# EAGLE design odbiornikpolygon (EAGLE 8.5.0)
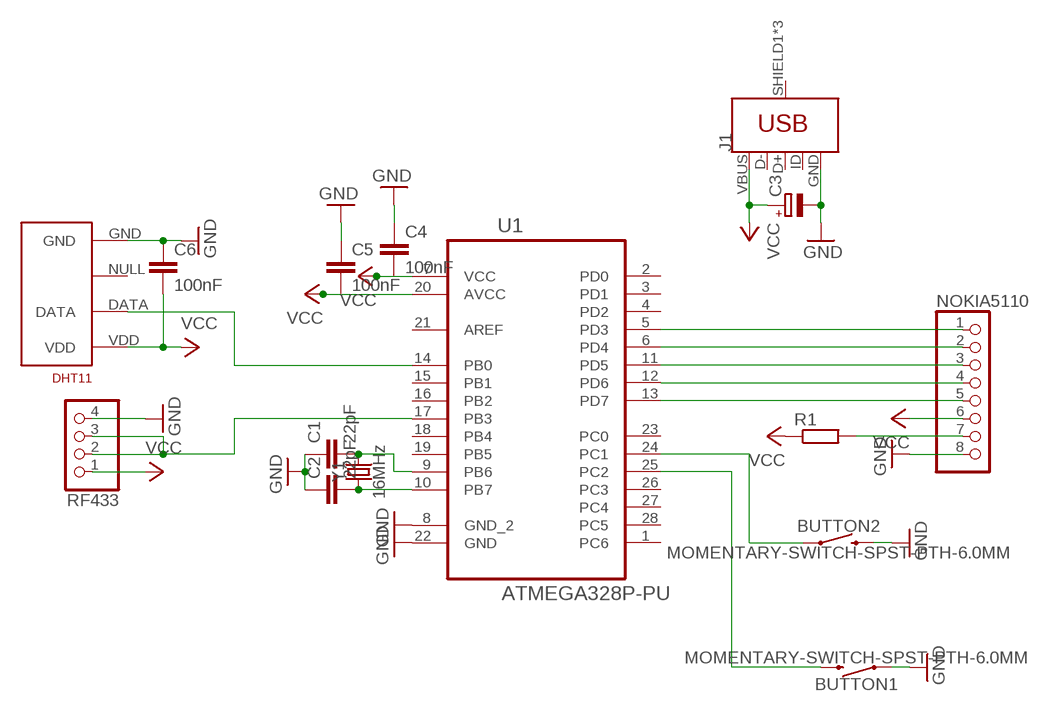
[diagram p0: schematic, sheet 1]

## Parts
BUTTON1  MOMENTARY-SWITCH-SPST-PTH-6.0MM  [TACTILE_SWITCH_PTH_6.0MM]
BUTTON2  MOMENTARY-SWITCH-SPST-PTH-6.0MM  [TACTILE_SWITCH_PTH_6.0MM]
C1  22pF  C-EU025-024X044  [C025-024X044]
C2  22pF  C-EU025-024X044  [C025-024X044]
C3  CPOL-EUE2-5  [E2-5]
C4  100nF  C-EU025-030X050  [C025-030X050]
C5  100nF  C-EU025-030X050  [C025-030X050]
C6  100nF  C-EU025-030X050  [C025-030X050]
DHT11  RHT03_DHT-22_AM2302  [RHT03_DHT-22]
J1  USB_MICRO-BREDUCED_PASTE  [USB-B-MICRO-SMD_RED_PASTE]
NOKIA5110  PINHD-1X8  [1X08]
R1  R-EU_0204/7  [0204/7]
RF433  PINHD-1X4  [1X04]
U1  ATMEGA328P-PU  [DIP254P762X457-28]
Y1  16MHz  CRYSTAL-16MHZPTH-HC49US  [HC49US]

## Nets
BL: NOKIA5110.7 R1.2
CE: NOKIA5110.2 U1.6(PD4)
CLK: NOKIA5110.5 U1.13(PD7)
DC: NOKIA5110.3 U1.11(PD5)
DIN: NOKIA5110.4 U1.12(PD6)
GND: BUTTON1.1 BUTTON2.3 C1.1 C2.1 C3.- C4.1 C5.1 C6.1 DHT11.GND J1.GND NOKIA5110.8 RF433.4 U1.8(GND_2) U1.22(GND)
N$1: BUTTON1.3 U1.25(PC2)
N$2: RF433.2 RF433.3 U1.17(PB3)
N$3: DHT11.DATA U1.14(PB0)
N$4: BUTTON2.1 U1.24(PC1)
N$5: C1.2 U1.9(PB6) Y1.2
N$6: C2.2 U1.10(PB7) Y1.1
RST: NOKIA5110.1 U1.5(PD3)
VCC: C3.+ C4.2 C5.2 C6.2 DHT11.VDD J1.VBUS NOKIA5110.6 R1.1 RF433.1 U1.7(VCC) U1.20(AVCC)
Unconnected: DHT11.NULL J1.D+ J1.D- J1.ID J1.SHIELD1(SHIELD) J1.SHIELD2(SHIELD) J1.SHIELD3(SHIELD) U1.1(PC6) U1.2(PD0) U1.3(PD1) U1.4(PD2) U1.15(PB1) U1.16(PB2) U1.18(PB4) U1.19(PB5) U1.21(AREF) U1.23(PC0) U1.26(PC3) U1.27(PC4) U1.28(PC5)

## Library data of the parts
BUTTON1 BUTTON2 = SparkFun-Switches:MOMENTARY-SWITCH-SPST: Momentary Switch (Pushbutton) - SPST Normally-open (NO) SPST momentary switches (buttons, pushbuttons). Variants PTH-12MM - 12mm square, through-hole Momentary Pushbutton Switch - 12mm Square <https://www.sparkfun.com/products/9190> (COM-09190) PTH-6.0MM, PTH-6.0MM-KIT - 6.0mm square, through-hole Mini Pushbutton Switch <https://www.sparkfun.com/products/97> (COM-00097) KIT package intended for soldering kit's - only one side of pads' copper is exposed. PTH-RIGHT-ANGLE-KIT - Right-angle, through-hole Right Angle Tactile Button <https://www.sparkfun.com/products/10791> - Used on SparkFun BigTime Watch Kit <https://www.sparkfun.com/products/11734> SMD-12MM - 12mm square, surface-mount Tactile Button - SMD (12mm) <https://www.sparkfun.com/products/12993> (COM-12993) Used on SparkFun PicoBoard <https://www.sparkfun.com/products/11888> SMD-4.5MM - 4.5mm Square Trackball Switch Used on SparkFun Blackberry Trackballer Breakout <https://www.sparkfun.com/products/13169> SMD-4.6MMX2.8MM - 4.60mm x 2.80mm, surface mount Used on SparkFun SAMD21 Mini Breakout <https://www.sparkfun.com/products/13664> SMD-5.2MM, SMD-5.2-REDUNDANT - 5.2mm square, surface-mount Mini Pushbutton Switch - SMD <https://www.sparkfun.com/products/8720> (COM-08720) Used on Arduino Pro Mini <https://www.sparkfun.com/products/11114> REDUNDANT package connects both switch circuits together SMD-6.0X3.5MM - 6.0 x 3.5mm, surface mount Momentary Reset Switch SMD <https://www.sparkfun.com/products/8229> (COM-08229) SMD-6.2MM-TALL - 6.2mm square, surface mount Tactile Button - SMD (6mm) <https://www.sparkfun.com/products/12992> Used on SparkFun Digital Sandbox <https://www.sparkfun.com/products/12651> SMD-RIGHT-ANGLE - Right-angle, surface mount Used on SparkFun Block for Intel® Edison - Arduino <https://www.sparkfun.com/products/13036>; PROD_ID: SWCH-08441; SF_SKU: COM-00097
C1 C2 C4-C6 = rcl:C-EU: CAPACITOR, European symbol; SPICEPREFIX: C
C3 = rcl:CPOL-EU: POLARIZED CAPACITOR, European symbol; SPICEPREFIX: C
DHT11 = RHT03_DHT-22_AM2302:RHT03_DHT-22_AM2302: RHT03 / DHT-22 / AM2302 Packages and symbol for the RHT03 / DHT-22 relative humidity and temperature sensor. Note: The AM2302 is a wired version of the DHT-22 which typically requires less clearance and is thus provided as a separate package.; PROD_ID: SEN-10167
J1 = SparkFun-Connectors:USB_MICRO-B: USB Type Micro-B Connector Male/female and PTH/SMT variants SparkFun Products: SparkFun microB USB Breakout <https://www.sparkfun.com/products/12035> SparkFun USB microB Plug Breakout <https://www.sparkfun.com/products/10031> SparkFun ESP8266 Thing <https://www.sparkfun.com/products/13231>; PROD_ID: CONN-11752
NOKIA5110 = pinhead:PINHD-1X8: PIN HEADER
R1 = rcl:R-EU_: RESISTOR, European symbol; SPICEPREFIX: R
RF433 = pinhead:PINHD-1X4: PIN HEADER
U1 = Atmel_By_element14_Batch_1-00:ATMEGA328P-PU: 8-bit Microcontroller with In-System Programmable Flash; MPN: ATMEGA328P-PU; OC_FARNELL: 1715487; OC_NEWARK: 15R0268; PACKAGE: PDIP-28; SUPPLIER: Atmel
Y1 = SparkFun-Clocks:CRYSTAL-16MHZ: 16MHz Crystal Digikey Example <http://www.digikey.com/product-search/en?keywords=535-9122-1-ND> Frequency: 16MHz Frequency Stability: ±50ppm Frequency Tolerance: ±20ppm Load Capacitance: 18pF SparkFun Products: Pro Micro -5V/16MHz <https://www.sparkfun.com/products/12640> SparkFun Serial Enabled LCD Kit <https://www.sparkfun.com/products/10097>; PROD_ID: XTAL-08181; SF_ID: COM-00536

## Board
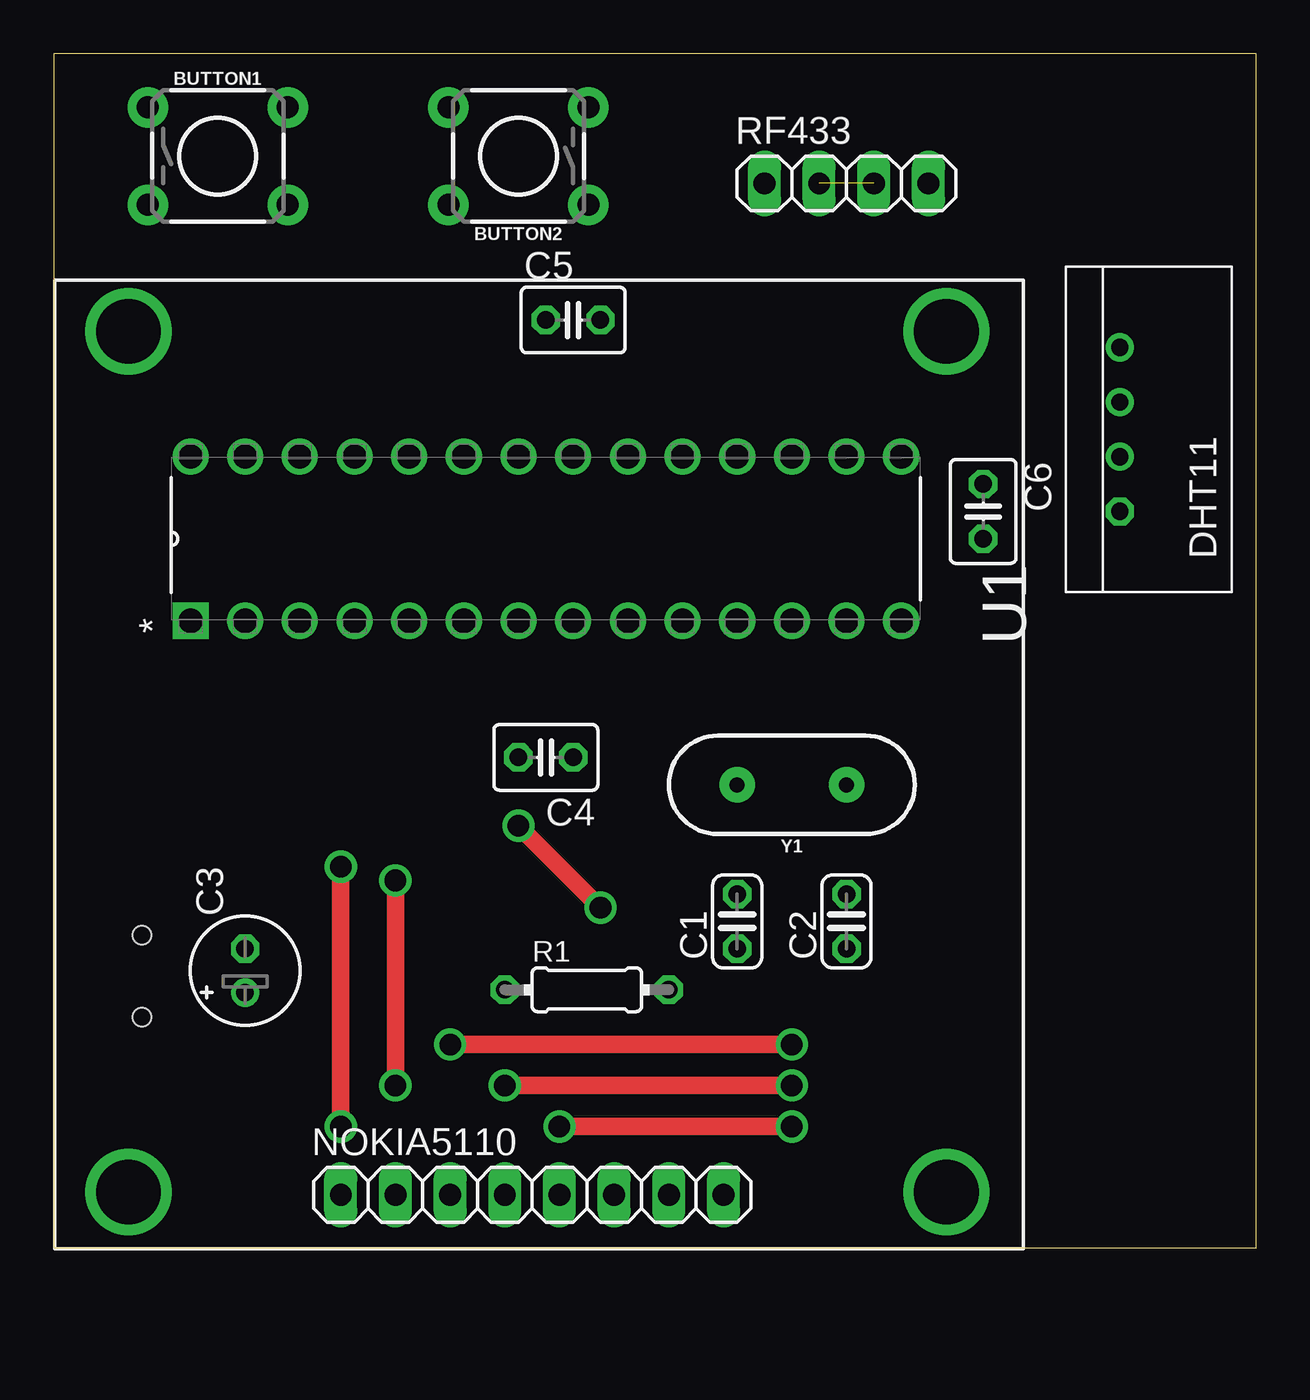
[diagram p1: board, top side]
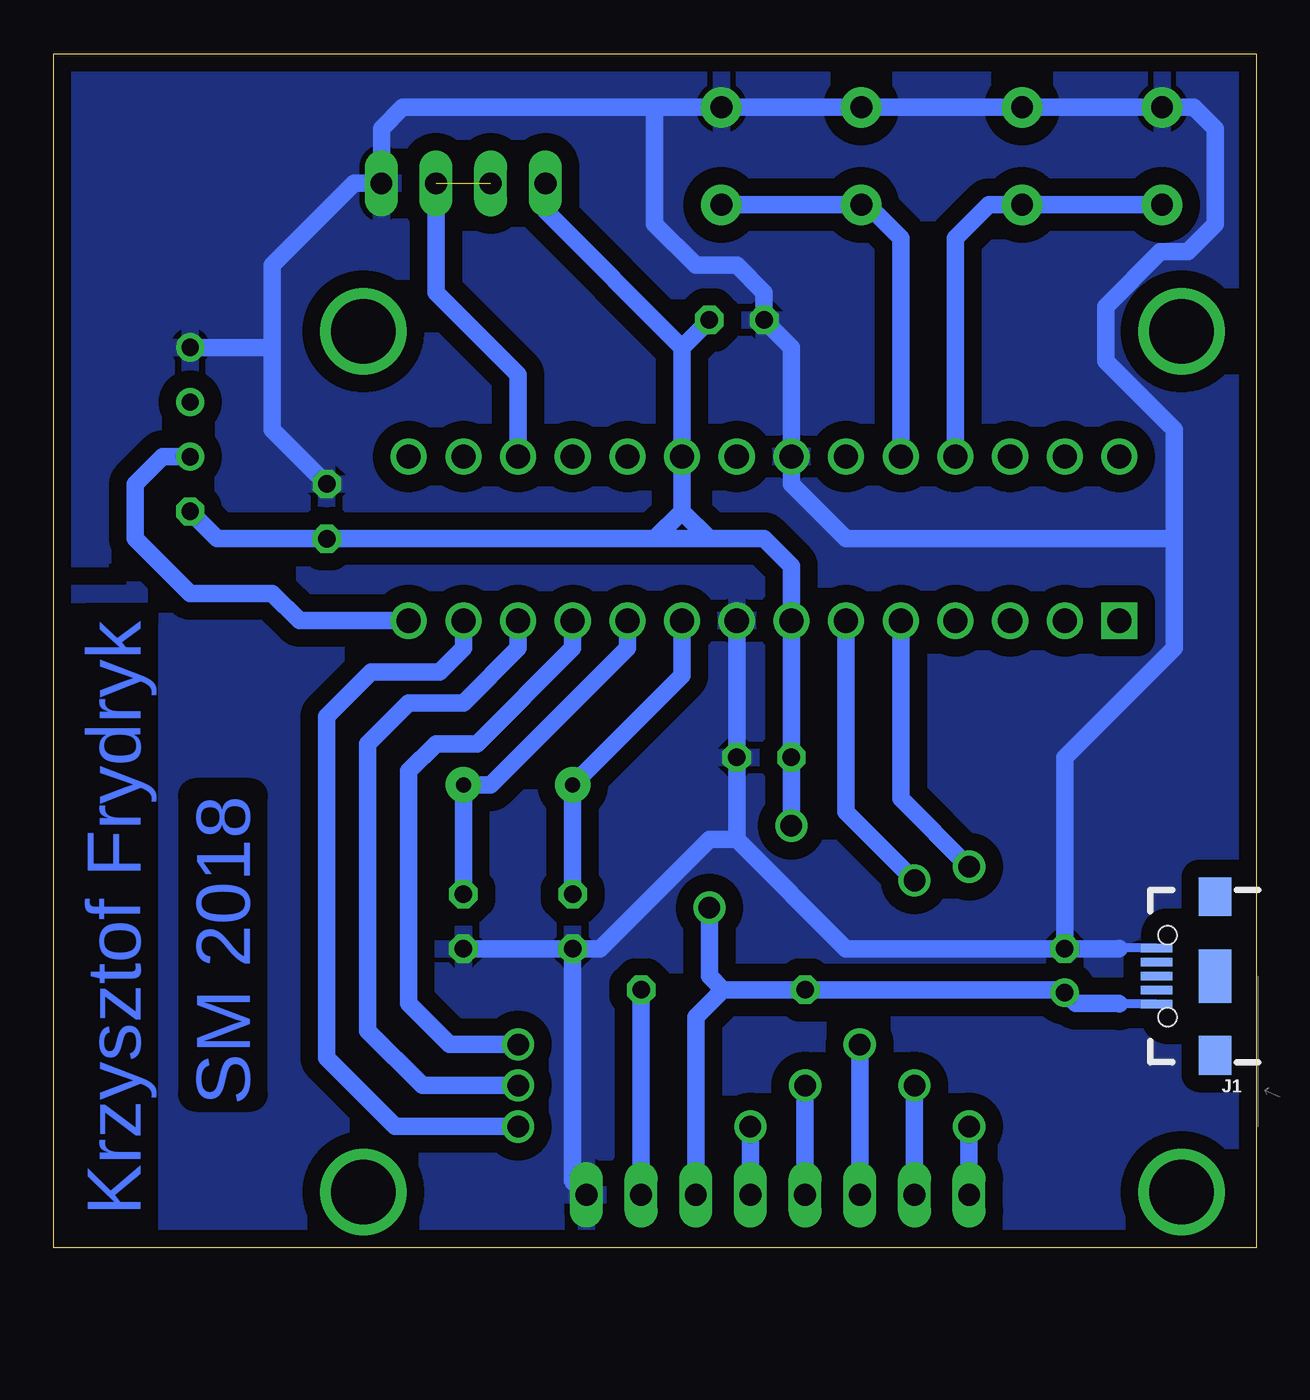
[diagram p2: board, bottom side, seen from below]

Size 55.86 x 55.47 mm. Coordinates in mm from the lower left corner, seen from the top.
Outline: 0,0 55.86,0 55.86,55.47 0,55.47 0,0
Copper layers (1*16): Top 0.035mm / dielectric 1.5mm / Bottom 0.035mm
Design rules "default *": minimum track width 24mil, minimum drill 25mil, track to track 24mil, track to pad 24mil, pad to pad 24mil, via to via 24mil, smd to smd 24mil, copper to edge 24mil, drill to drill 24mil, minimum pad ring 10mil, minimum via ring 8mil, stop-mask expansion 4mil, vias tented up to drill 0mil, thermal gap 10mil

### Footprints (pad centres in the part's own frame; a part is rotated, then mirrored left to right if it is on the bottom)
TACTILE_SWITCH_PTH_6.0MM = drill 1.016 pad 1.88: 1 -3.251,2.261; 2 3.251,2.261; 3 -3.251,-2.261; 4 3.251,-2.261
C025-024X044 = drill 0.813 octagon: 1 -1.27,0; 2 1.27,0
E2-5 = drill 0.813 pad 1.27: + -1.016,0 | drill 0.813 pad 1.27 octagon: - 1.016,0
C025-030X050 = drill 0.813 octagon: 1 -1.27,0; 2 1.27,0
RHT03_DHT-22 = drill 0.8: DATA -1.27,0; GND 3.81,0; NULL 1.27,0 | drill 0.8 octagon: VDD -3.81,0
USB-B-MICRO-SMD_RED_PASTE = smd 1.45 x 0.4: D+ 2.725,0; D- 2.725,0.65; GND 2.725,-1.3; ID 2.725,-0.65; VBUS 2.725,1.3 | smd 1.5 x 1.8: SHIELD1 0,3.685; SHIELD2 0,-3.685 | smd 1.5 x 2.5: SHIELD3 0,0 | hole 0.85: 2.2,1.9; 2.2,-1.9
1X08 = drill 1.016 long: 1 -8.89,0; 2 -6.35,0; 3 -3.81,0; 4 -1.27,0; 5 1.27,0; 6 3.81,0; 7 6.35,0; 8 8.89,0
0204/7 = drill 0.813 octagon: 1 -3.81,0; 2 3.81,0
1X04 = drill 1.016 long: 1 -3.81,0; 2 -1.27,0; 3 1.27,0; 4 3.81,0
DIP254P762X457-28 = drill 1.118 square: 1 -7.62,33.02 | drill 1.118: 2 -7.62,30.48; 3 -7.62,27.94; 4 -7.62,25.4; 5 -7.62,22.86; 6 -7.62,20.32; 7 -7.62,17.78; 8 -7.62,15.24; 9 -7.62,12.7; 10 -7.62,10.16; 11 -7.62,7.62; 12 -7.62,5.08; 13 -7.62,2.54; 14 -7.62,0; 15 0,0; 16 0,2.54; 17 0,5.08; 18 0,7.62; 19 0,10.16; 20 0,12.7; 21 0,15.24; 22 0,17.78; 23 0,20.32; 24 0,22.86; 25 0,25.4; 26 0,27.94; 27 0,30.48; 28 0,33.02
HC49US = drill 0.7 pad 1.651: 1 -2.54,0; 2 2.54,0

### Placement (x,y rotation side)
BUTTON1  7.62,50.72 0 top
BUTTON2  21.59,50.72 180 top
C1  31.75,15.16 90 top
C2  36.83,15.16 90 top
C3  8.89,12.87 90 top
C4  22.86,22.78 180 top
C5  24.13,43.1 0 top
C6  43.18,34.21 270 top
DHT11  49.53,38.02 90 top
J1  1.9,12.62 180 bottom
NOKIA5110  22.23,2.46 0 top
R1  24.77,11.98 0 top
RF433  36.83,49.45 0 top
U1  39.37,36.75 90 top
Y1  34.29,21.51 180 top

### Tracks (layer width: path | path; a pad name or v marks a point on that pad's centre or on a via)
BL
  Bottom 0.813: R1.2 NOKIA5110.7
CE  (via drill 1)
  Top 0.813: v15.88,17.06 v15.88,7.54
  Bottom 0.813: U1.6 19.05,20.24 v15.88,17.06 | NOKIA5110.2 v15.88,7.54
CLK  (via drill 1)
  Top 0.813: v23.49,5.63 v34.29,5.63
  Bottom 0.813: U1.13 36.83,27.86 37.95,26.74 41.12,26.74 43.18,24.68 43.18,8.81 40,5.63 v34.29,5.63 | NOKIA5110.5 v23.49,5.63
DC  (via drill 1)
  Top 0.813: v18.41,9.44 v34.29,9.44
  Bottom 0.813: U1.11 31.75,27.86 36.2,23.41 38.1,23.41 39.37,22.14 39.37,11.35 37.47,9.44 v34.29,9.44 | NOKIA5110.3 v18.41,9.44
DIN  (via drill 1)
  Top 0.813: v34.29,7.54 v20.95,7.54
  Bottom 0.813: U1.12 34.29,27.86 36.83,25.32 39.37,25.32 41.27,23.41 41.27,10.08 38.73,7.54 v34.29,7.54 | NOKIA5110.4 v20.95,7.54
GND
  Bottom 0.406: J1.GND 6.34,13.92 6.37,13.89
  Bottom 0.813: 24.13,18.97 19.05,13.89 C3.- | 24.13,18.97 C4.1 U1.8 | C1.1 31.75,3.09 NOKIA5110.8 | C2.1 C1.1 | C1.1 30.48,13.89 25.4,18.97 24.13,18.97 | 3.81,32.94 3.81,38.02 6.98,41.19 6.98,43.73 4.44,46.27 3.17,46.27 1.9,47.54 1.9,51.99 2.9,52.98 BUTTON1.1 BUTTON2.3 27.94,52.98 | 3.81,32.94 3.81,27.86 8.89,22.78 C3.- | 3.81,32.94 19.05,32.94 21.59,35.48 U1.22 21.59,41.83 C5.1 22.86,44.37 24.13,45.64 26.03,45.64 27.94,47.54 27.94,52.98 | C6.1 45.72,38.02 45.72,41.83 | 45.72,41.83 45.72,45.64 41.91,49.45 RF433.4 40.64,51.99 39.65,52.98 27.94,52.98 | C3.- 6.37,13.89 6.36,13.9 | DHT11.GND 45.72,41.83
  pour Bottom (isolate 0.813, rank 2): 0,55.8 0,-0.08 55.88,-0.08 55.88,55.8
N$1
  Bottom 0.813: BUTTON1.3 12.42,48.46 13.97,46.91 U1.25
N$2  (1 unrouted)
  Bottom 0.813: U1.17 34.29,40.56 38.1,44.37 RF433.3
N$3
  Bottom 0.813: DHT11.DATA 50.8,36.75 52.07,35.48 52.07,32.94 49.53,30.4 45.72,30.4 44.45,29.13 U1.14
N$4
  Bottom 0.813: BUTTON2.1 18.06,48.46 16.51,46.91 U1.24
N$5
  Bottom 0.813: U1.9 26.67,26.59 Y1.2 C1.2
N$6
  Bottom 0.813: U1.10 29.21,27.86 35.56,21.51 Y1.1 C2.2
N$7  (via drill 3 pad 4)
  other vias: 3.47,42.58
N$8  (via drill 3 pad 4)
  other vias: 41.47,42.58
N$9  (via drill 3 pad 4)
  other vias: 41.47,2.58
N$10  (via drill 3 pad 4)
  other vias: 3.47,2.58
N$11
  pour Bottom (isolate 0.813): 27.94,36.75 34.29,36.75 34.29,40.56 38.1,44.37 38.1,49.45 33.02,49.45 33.02,48.18 26.67,41.83 26.67,36.75
N$12
  pour Bottom (isolate 0.813): 39.37,29.13 26.67,29.13 26.67,26.59 31.75,21.51 33.02,22.78 34.29,22.78 35.56,21.51 36.83,21.51 36.83,16.43 36.83,13.89 39.37,13.89 39.37,11.35 36.83,8.81 36.83,6.27 36.83,5.63 38.73,5.63 39.37,5 40.64,3.73 40.64,-0.08 55.88,-0.08 55.88,30.4 52.07,30.4 52.07,35.48 49.53,35.48 49.53,34.21 48.26,32.94 45.72,32.94 45.72,30.4 44.45,29.13
N$13
  pour Bottom (isolate 0.813): 31.11,-0.08 31.11,2.46 29.84,2.46 28.57,3.73 28.57,11.98 4.44,11.98 4.44,13.25 0,17.7 0,-0.08
RST  (via drill 1)
  Top 0.813: v13.34,5.63 v13.34,17.7
  Bottom 0.813: U1.5 16.51,20.87 v13.34,17.7 | NOKIA5110.1 v13.34,5.63
VCC  (via drill 1)
  Top 0.813: v25.4,15.79 v21.59,19.6
  Bottom 0.406: J1.VBUS 6.34,11.32 6.37,11.35
  Bottom 0.813: 26.67,41.83 U1.20 26.67,34.21 | 26.67,41.83 C5.2 | 26.67,41.83 33.02,48.18 RF433.1 | 27.94,32.94 C6.2 48.26,32.94 DHT11.VDD | 27.94,32.94 25.4,32.94 | 25.4,32.94 22.86,32.94 21.59,31.67 U1.7 C4.2 v21.59,19.6 | 27.94,32.94 26.67,34.21 | 26.67,34.21 25.4,32.94 | NOKIA5110.6 26.03,10.71 24.77,11.98 | 24.77,11.98 R1.1 9.02,11.98 C3.+ 8.38,11.35 6.37,11.35 6.36,11.34 | 24.77,11.98 25.4,12.62 v25.4,15.79

### Text on the board
Bottom: Krzysztof Frydryk | SM 2018